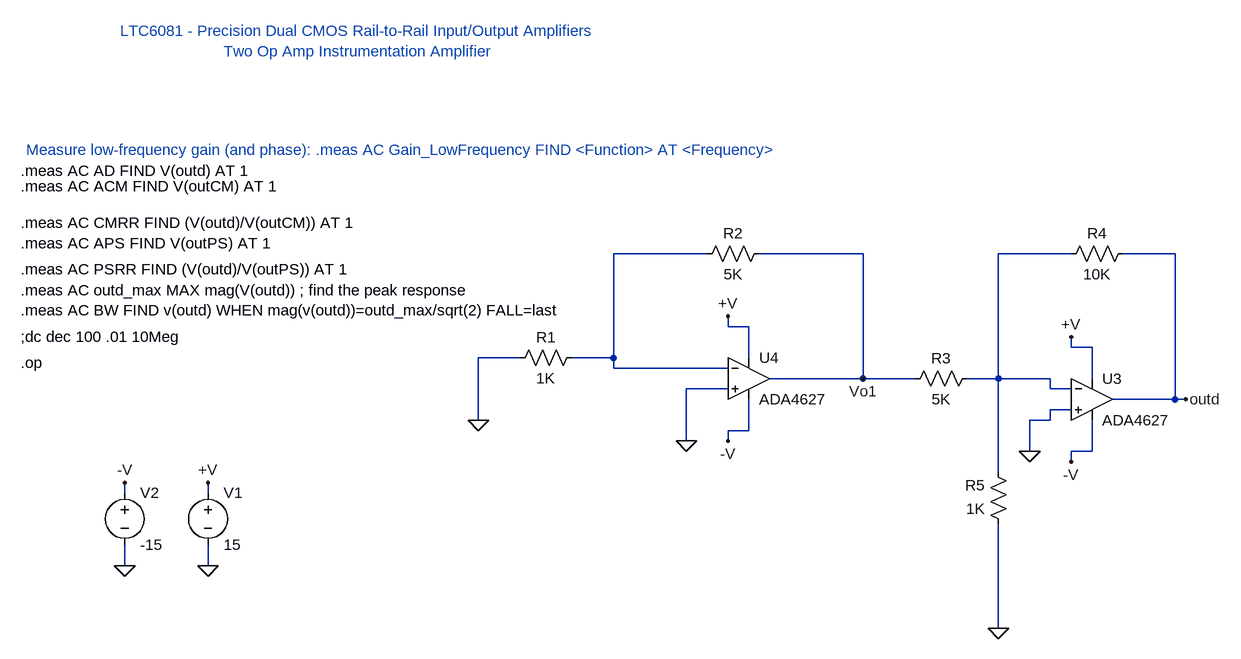
[diagram p0: schematic Etaj1-Laborator DC.asc]
Etaj1-Laborator DC.asc, the LTspice schematic file:
Version 4
SHEET 1 1248 2108
WIRE 96 48 -48 48
WIRE 336 48 176 48
WIRE 656 48 544 48
WIRE 816 48 736 48
WIRE 128 160 128 144
WIRE 160 160 128 160
WIRE 656 192 656 176
WIRE 688 192 656 192
WIRE -192 208 -256 208
WIRE -48 208 -48 48
WIRE -48 208 -112 208
WIRE 160 208 160 160
WIRE -48 224 -48 208
WIRE 128 224 -48 224
WIRE 336 240 336 48
WIRE 336 240 192 240
WIRE 416 240 336 240
WIRE 544 240 544 48
WIRE 544 240 496 240
WIRE 624 240 544 240
WIRE 688 240 688 192
WIRE 128 256 64 256
WIRE 624 256 624 240
WIRE 656 256 624 256
WIRE 816 272 816 48
WIRE 816 272 720 272
WIRE 832 272 816 272
WIRE 656 288 624 288
WIRE -256 304 -256 208
WIRE 624 304 624 288
WIRE 624 304 592 304
WIRE 160 320 160 272
WIRE 160 320 128 320
WIRE 64 336 64 256
WIRE 128 336 128 320
WIRE 592 352 592 304
WIRE 688 352 688 304
WIRE 688 352 656 352
WIRE 656 368 656 352
WIRE 544 384 544 240
WIRE -800 416 -800 400
WIRE -672 416 -672 400
WIRE -800 528 -800 496
WIRE -672 528 -672 496
WIRE 544 624 544 464
FLAG -672 528 0
FLAG 128 144 +V
FLAG -672 400 +V
FLAG 128 336 -V
FLAG -800 528 0
FLAG -800 400 -V
FLAG 656 176 +V
FLAG 656 368 -V
FLAG 832 272 outd
FLAG 64 336 0
FLAG 592 352 0
FLAG -256 304 0
FLAG 544 624 0
FLAG 336 240 Vo1
SYMBOL voltage -672 400 R0
WINDOW 123 0 0 Left 2
WINDOW 39 0 0 Left 2
SYMATTR InstName V1
SYMATTR Value 15
SYMBOL voltage -800 400 R0
WINDOW 123 0 0 Left 2
WINDOW 39 0 0 Left 2
SYMATTR InstName V2
SYMATTR Value -15
SYMBOL res -96 192 R90
WINDOW 0 0 56 VBottom 2
WINDOW 3 32 56 VTop 2
SYMATTR InstName R1
SYMATTR Value 1K
SYMBOL res 192 32 R90
WINDOW 0 0 56 VBottom 2
WINDOW 3 32 56 VTop 2
SYMATTR InstName R2
SYMATTR Value 5K
SYMBOL res 512 224 R90
WINDOW 0 0 56 VBottom 2
WINDOW 3 32 56 VTop 2
SYMATTR InstName R3
SYMATTR Value 5K
SYMBOL res 752 32 R90
WINDOW 0 0 56 VBottom 2
WINDOW 3 32 56 VTop 2
SYMATTR InstName R4
SYMATTR Value 10K
SYMBOL res 560 480 R180
WINDOW 0 36 76 Left 2
WINDOW 3 36 40 Left 2
SYMATTR InstName R5
SYMATTR Value 1K
SYMBOL OpAmps\\ADA4627 688 208 R0
SYMATTR InstName U3
SYMBOL OpAmps\\ADA4627 160 176 R0
SYMATTR InstName U4
TEXT -440 -248 Bottom 2 ;LTC6081 - Precision Dual CMOS Rail-to-Rail Input/Output Amplifiers\nTwo Op Amp Instrumentation Amplifier
TEXT -960 176 Left 2 !;dc dec 100 .01 10Meg
TEXT -960 -80 Left 2 !.meas AC AD FIND V(outd) AT 1
TEXT -952 -112 Left 2 ;Measure low-frequency gain (and phase): .meas AC Gain_LowFrequency FIND <Function> AT <Frequency>
TEXT -960 -56 Left 2 !.meas AC ACM FIND V(outCM) AT 1
TEXT -960 0 Left 2 !.meas AC CMRR FIND (V(outd)/V(outCM)) AT 1
TEXT -960 72 Left 2 !.meas AC PSRR FIND (V(outd)/V(outPS)) AT 1
TEXT -960 32 Left 2 !.meas AC APS FIND V(outPS) AT 1
TEXT -960 104 Left 2 !.meas AC outd_max MAX mag(V(outd)) ; find the peak response\n.meas AC BW FIND v(outd) WHEN mag(v(outd))=outd_max/sqrt(2) FALL=last
TEXT -960 216 Left 2 !.op

The netlist it stands for:
* Etaj1-Laborator DC.asc
V1 +V 0 15
V2 -V 0 -15
R1 N001 0 1K
R2 Vo1 N001 5K
R3 N002 Vo1 5K
R4 outd N002 10K
R5 0 N002 1K
XU3 0 N002 +V -V outd ADA4627  ; pins In+ In- V+ V- OUT
XU4 0 N001 +V -V Vo1 ADA4627  ; pins In+ In- V+ V- OUT
* LTC6081 - Precision Dual CMOS Rail-to-Rail Input/Output Amplifiers
* Two Op Amp Instrumentation Amplifier
;dc dec 100 .01 10Meg
.meas AC AD FIND V(outd) AT 1
* Measure low-frequency gain (and phase): .meas AC Gain_LowFrequency FIND <Function> AT <Frequency>
.meas AC ACM FIND V(outCM) AT 1
.meas AC CMRR FIND (V(outd)/V(outCM)) AT 1
.meas AC PSRR FIND (V(outd)/V(outPS)) AT 1
.meas AC APS FIND V(outPS) AT 1
.meas AC outd_max MAX mag(V(outd)) ; find the peak response
.meas AC BW FIND v(outd) WHEN mag(v(outd))=outd_max/sqrt(2) FALL=last
.op
.backanno
.end